# EAGLE design Shruthi-Analog-SMR4-mkII-v02 (EAGLE 5.09)
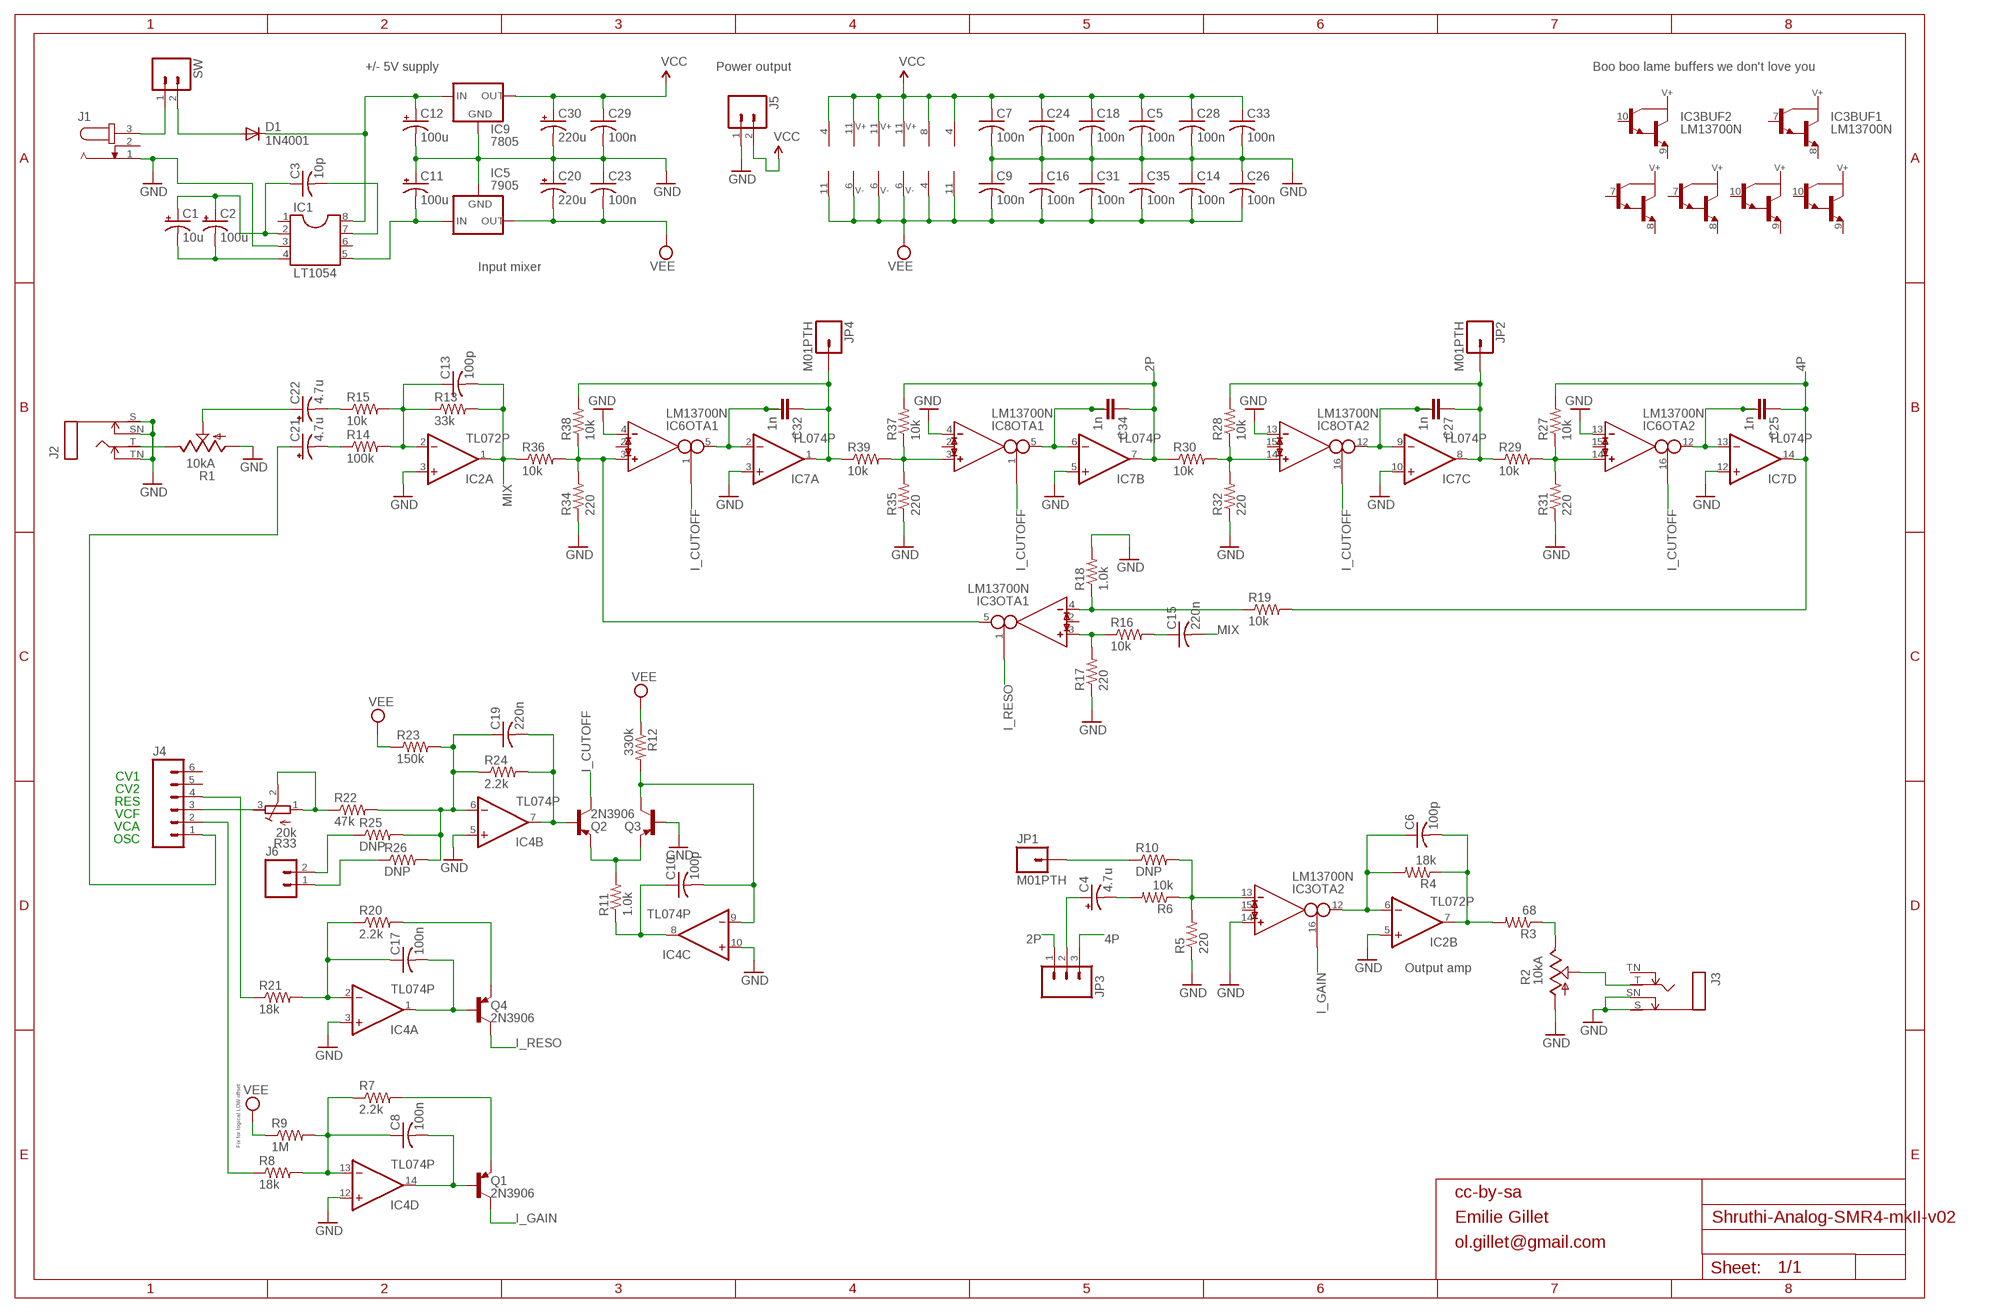
[diagram p0: schematic, sheet 1]

## Parts
C1  10u  CPOL-USE2.5-5  [E2,5-5]
C2  100u  CPOL-USE2.5-6  [E2,5-6]
C3  10p  C-US025-025X050  [C025-025X050]
C4  4.7u  CPOL-USE2.5-6  [E2,5-6]
C5  100n  C-US025-025X050  [C025-025X050]
C6  100p  C-US025-025X050  [C025-025X050]
C7  100n  C-US025-025X050  [C025-025X050]
C8  100n  C-US025-025X050  [C025-025X050]
C9  100n  C-US025-025X050  [C025-025X050]
C10  100p  C-US025-025X050  [C025-025X050]
C11  100u  CPOL-USE2.5-7  [E2,5-7]
C12  100u  CPOL-USE2.5-7  [E2,5-7]
C13  100p  C-US025-025X050  [C025-025X050]
C14  100n  C-US025-025X050  [C025-025X050]
C15  220n  C-US025-025X050  [C025-025X050]
C16  100n  C-US025-025X050  [C025-025X050]
C17  100n  C-US025-025X050  [C025-025X050]
C18  100n  C-US025-025X050  [C025-025X050]
C19  220n  C-US025-025X050  [C025-025X050]
C20  220u  CPOL-USE5-10.5  [E5-10,5]
C21  4.7u  CPOL-USE2.5-6  [E2,5-6]
C22  4.7u  CPOL-USE2.5-6  [E2,5-6]
C23  100n  C-US025-025X050  [C025-025X050]
C24  100n  C-US025-025X050  [C025-025X050]
C25  1n  C-2.5-5/2  [C2.5/5-2]
C26  100n  C-US025-025X050  [C025-025X050]
C27  1n  C-2.5-5/2  [C2.5/5-2]
C28  100n  C-US025-025X050  [C025-025X050]
C29  100n  C-US025-025X050  [C025-025X050]
C30  220u  CPOL-USE5-10.5  [E5-10,5]
C31  100n  C-US025-025X050  [C025-025X050]
C32  1n  C-2.5-5/2  [C2.5/5-2]
C33  100n  C-US025-025X050  [C025-025X050]
C34  1n  C-2.5-5/2  [C2.5/5-2]
C35  100n  C-US025-025X050  [C025-025X050]
D1  1N4001  1N4004  [DO41-10]
IC1  LT1054  DIL8  [DIL08]
IC2  TL072P  [DIL08]
IC3  LM13700N  [DIL16]
IC4  TL074P  TL084P  [DIL14]
IC5  7905  79XXS  [79XXS]
IC6  LM13700N  [DIL16]
IC7  TL074P  TL084P  [DIL14]
IC8  LM13700N  [DIL16]
IC9  7805  78XXS  [78XXS]
J1  JACK-PLUG2  [SPC4078_BIG_HOLES]
J2  MONOSWS  [NMJ4HC-S]
J3  MONOSWS  [NMJ4HC-S]
J4  M06SIP  [1X06]
J5  M02PTH  [1X02]
J6  M02PTH  [1X02]
JP1  M01PTH  [1X01]
JP2  M01PTH  [1X01]
JP3  M03PTH  [1X03]
JP4  M01PTH  [1X01]
Q1  2N3906  2N3906-  [TO92-]
Q2  2N3906  2N3906-  [TO92-]
Q3  2N3906  2N3906-  [TO92-]
Q4  2N3906  2N3906-  [TO92-]
R1  10kA  POT_USCABLED  [CABLE_POT_6MM]
R2  10kA  POT_USCABLED  [CABLE_POT_6MM]
R3  68  R-US_0204/7  [0204/7]
R4  18k  R-US_0204/7  [0204/7]
R5  220  R-US_0204/7  [0204/7]
R6  10k  R-US_0204/7  [0204/7]
R7  2.2k  R-US_0204/7  [0204/7]
R8  18k  R-US_0204/7  [0204/7]
R9  1M  R-US_0204/7  [0204/7]
R10  DNP  R-US_0204/2V  [0204V]
R11  1.0k  R-US_0204/7  [0204/7]
R12  330k  R-US_0204/7  [0204/7]
R13  33k  R-US_0204/7  [0204/7]
R14  100k  R-US_0204/7  [0204/7]
R15  10k  R-US_0204/7  [0204/7]
R16  10k  R-US_0204/7  [0204/7]
R17  220  R-US_0204/7  [0204/7]
R18  1.0k  R-US_0204/7  [0204/7]
R19  10k  R-US_0204/7  [0204/7]
R20  2.2k  R-US_0204/7  [0204/7]
R21  18k  R-US_0204/7  [0204/7]
R22  47k  R-US_0204/7  [0204/7]
R23  150k  R-US_0204/7  [0204/7]
R24  2.2k  R-US_0204/7  [0204/7]
R25  DNP  R-US_0204/2V  [0204V]
R26  DNP  R-US_0204/2V  [0204V]
R27  10k  R-US_0204/7  [0204/7]
R28  10k  R-US_0204/7  [0204/7]
R29  10k  R-US_0204/7  [0204/7]
R30  10k  R-US_0204/7  [0204/7]
R31  220  R-US_0204/7  [0204/7]
R32  220  R-US_0204/7  [0204/7]
R33  20k  R-TRIMM3296X  [RTRIM3296X]
R34  220  R-US_0204/7  [0204/7]
R35  220  R-US_0204/7  [0204/7]
R36  10k  R-US_0204/7  [0204/7]
R37  10k  R-US_0204/7  [0204/7]
R38  10k  R-US_0204/7  [0204/7]
R39  10k  R-US_0204/7  [0204/7]
SW  M02PTH  [1X02]

## Nets
2P: C34.1 IC7.7(B:OUT) JP3.1 R30.1 R37.2
4P: C25.1 IC7.14(D:OUT) JP3.3 R19.2 R27.2
GND: C5.2 C7.2 C9.1 C11.+ C12.- C14.1 C16.1 C18.2 C20.+ C23.1 C24.2 C26.1 C28.2 C29.2 C30.- C31.1 C33.2 C35.1 IC1.3 IC2.3(A:+IN) IC2.5(B:+IN) IC3.14(OTA2:IN_P) IC4.3(A:+IN) IC4.5(B:+IN) IC4.10(C:+IN) IC4.12(D:+IN) IC5.GND IC6.4(OTA1:IN_N) IC6.13(OTA2:IN_N) IC7.3(A:+IN) IC7.5(B:+IN) IC7.10(C:+IN) IC7.12(D:+IN) IC8.4(OTA1:IN_N) IC8.13(OTA2:IN_N) IC9.GND J1.1 J2.S J2.SN J2.TN J3.S J3.SN J5.1 Q3.2(B) R1.A R2.A R5.1 R17.1 R18.2 R31.1 R32.1 R34.1 R35.1
I_CUTOFF: IC6.1(OTA1:I_BIAS) IC6.16(OTA2:I_BIAS) IC8.1(OTA1:I_BIAS) IC8.16(OTA2:I_BIAS) Q2.1(C)
I_GAIN: IC3.16(OTA2:I_BIAS) Q1.1(C)
I_RESO: IC3.1(OTA1:I_BIAS) Q4.1(C)
MIX: C13.2 C15.2 IC2.1(A:OUT) R13.2 R36.1
N$1: JP1.1 R10.1
N$2: C19.2 IC4.7(B:OUT) Q2.2(B) R24.2
N$3: R22.1 R33.1(E) R33.2(S)
N$4: J4.3 R33.3(A)
N$6: C13.1 IC2.2(A:-IN) R13.1 R14.2 R15.2
N$7: Q2.3(E) Q3.3(E) R11.2
N$8: C4.+ JP3.2
N$9: C10.1 IC4.8(C:OUT) R11.1
N$10: C10.2 IC4.9(C:-IN) Q3.1(C) R12.2
N$11: J4.4 R21.1
N$12: IC3.5(OTA1:OUT) IC6.3(OTA1:IN_P) R34.2 R36.2 R38.1
N$13: J3.T R2.S
N$14: C32.1 IC7.1(A:OUT) JP4.1 R38.2 R39.1
N$16: IC8.3(OTA1:IN_P) R35.2 R37.1 R39.2
N$17: C4.- R6.2
N$18: J6.2 R25.1
N$20: IC8.14(OTA2:IN_P) R28.1 R30.2 R32.2
N$21: C15.1 R16.2
N$22: J6.1 R26.1
N$24: IC6.14(OTA2:IN_P) R27.1 R29.2 R31.2
N$25: R2.E R3.1
N$26: C27.1 IC7.8(C:OUT) JP2.1 R28.2 R29.1
N$27: C32.2 C32.3 IC6.5(OTA1:OUT) IC7.2(A:-IN)
N$28: C34.2 C34.3 IC7.6(B:-IN) IC8.5(OTA1:OUT)
N$29: IC3.4(OTA1:IN_N) R18.1 R19.1
N$30: C17.2 IC4.1(A:OUT) Q4.2(B)
N$31: C8.2 IC4.14(D:OUT) Q1.2(B)
N$33: IC3.3(OTA1:IN_P) R16.1 R17.2
N$34: IC3.13(OTA2:IN_N) R5.2 R6.1 R10.2
N$35: C21.+ J4.1
N$36: C27.2 C27.3 IC7.9(C:-IN) IC8.12(OTA2:OUT)
N$37: C25.2 C25.3 IC6.12(OTA2:OUT) IC7.13(D:-IN)
N$38: J2.T R1.E
N$39: C21.- R14.1
N$40: C19.1 IC4.6(B:-IN) R22.2 R23.2 R24.1 R25.2 R26.2
N$44: J1.3 SW.1
N$45: J4.2 R8.1
N$46: C12.+ D1.C IC1.8 IC9.IN
N$47: C1.+ C2.+ C3.1 IC1.2
N$48: C1.- C2.- IC1.4
N$49: C3.2 IC1.7
N$51: C8.1 IC4.13(D:-IN) R7.1 R8.2 R9.2
N$57: C17.1 IC4.2(A:-IN) R20.1 R21.2
N$58: C11.- IC1.5 IC5.IN
N$59: D1.A SW.2
N$60: Q4.3(E) R20.2
N$63: C6.2 IC2.7(B:OUT) R3.2 R4.1
N$66: C22.+ R1.S
N$68: Q1.3(E) R7.2
N$70: C6.1 IC2.6(B:-IN) IC3.12(OTA2:OUT) R4.2
N$72: C22.- R15.1
VCC: C5.1 C7.1 C18.1 C24.1 C28.1 C29.1 C30.+ C33.1 IC2.8(P:V+) IC3.11(SUPPLY:V+) IC4.4(P:V+) IC6.11(SUPPLY:V+) IC7.4(P:V+) IC8.11(SUPPLY:V+) IC9.OUT J5.2
VEE: C9.2 C14.2 C16.2 C20.- C23.2 C26.2 C31.2 C35.2 IC2.4(P:V-) IC3.6(SUPPLY:V-) IC4.11(P:V-) IC5.OUT IC6.6(SUPPLY:V-) IC7.11(P:V-) IC8.6(SUPPLY:V-) R9.1 R12.1 R23.1
Unconnected: IC1.1 IC1.6 IC3.2(OTA1:I_DIODE) IC3.7(BUF1:B) IC3.8(BUF1:E) IC3.9(BUF2:E) IC3.10(BUF2:B) IC3.15(OTA2:I_DIODE) IC6.2(OTA1:I_DIODE) IC6.7(BUF1:B) IC6.8(BUF1:E) IC6.9(BUF2:E) IC6.10(BUF2:B) IC6.15(OTA2:I_DIODE) IC8.2(OTA1:I_DIODE) IC8.7(BUF1:B) IC8.8(BUF1:E) IC8.9(BUF2:E) IC8.10(BUF2:B) IC8.15(OTA2:I_DIODE) J1.2 J3.TN J4.5 J4.6

## Notes on the sheet
- +/- 5V supply | Power output | Boo boo lame buffers we don't love you
- Input mixer
- CV1
- CV2
- RES
- VCF
- VCA
- OSC
- Output amp
- Fix for logical LOW offset
- cc-by-sa
- Emilie Gillet
- ol.gillet@gmail.com

## Library data of the parts
C1 C2 C4 C11 C12 C20-C22 C30 = rcl:CPOL-US: POLARIZED CAPACITOR, American symbol
C3 C5-C10 C13-C19 C23 C24 C26 C28 C29 C31 C33 C35 = rcl:C-US: CAPACITOR, American symbol
C25 C27 C32 C34 = capacitor-wima:C-: CAPACITOR for alternative placement naming: default grid - extended grid/package width
D1 = diode:1N4004: DIODE general purpose rectifier, 1 A
IC1 = ic-package:DIL8: Dual In Line / Socket
IC2 = gm-ics:TL072: OP AMP
IC3 IC6 IC8 = ota:LM13700: Dual OTA with buffers
IC4 IC7 = linear:TL084: OP AMP
IC5 = v-reg:79XXS: VOLTAGE REGULATOR
IC9 = v-reg:78XXS: VOLTAGE REGULATOR
J1 = con-jack2:JACK-PLUG: DC POWER JACK Power Jack, DC, Right Angle, Through Hole, Rated 5A at 16VDC, PC Terminals Distributor: Farnell (www.Farnell.de) Drawing: 84N1161.pdf / 84N1162.pdf Manufacturer: SPC Technology (www.spctechnology.com) Type: SPC4077 / SPC 4078
J2 J3 = og-neutrik:MONOSW
J4 = SparkFun:M06: Header 6 Standard 6-pin 0.1" header. Use with straight break away headers (SKU : PRT-00116), right angle break away headers (PRT-00553), swiss pins (PRT-00743), machine pins (PRT-00117), and female headers (PRT-00115). Molex polarized connector foot print use with SKU : PRT-08094 with associated crimp pins and housings. NOTES ON THE VARIANTS LOCK and LOCK_LONGPADS... This footprint was designed to help hold the alignment of a through-hole component (i.e. 6-pin header) while soldering it into place. You may notice that each hole has been shifted either up or down by 0.005 of an inch from it's more standard position (which is a perfectly straight line). This slight alteration caused the pins (the squares in the middle) to touch the edges of the holes. Because they are alternating, it causes a "brace" to hold the component in place. 0.005 has proven to be the perfect amount of "off-center" position when using our standard breakaway headers. Although looks a little odd when you look at the bare footprint, once you have a header in there, the alteration is very hard to notice. Also, if you push a header all the way into place, it is covered up entirely on the bottom side. This idea of altering the position of holes to aid alignment will be further integrated into the Sparkfun Library for other footprints. It can help hold any component with 3 or more connection pins.
J5 J6 SW = SparkFun:M02: Header 2 Standard 2-pin 0.1" header. Use with straight break away headers (SKU : PRT-00116), right angle break away headers (PRT-00553), swiss pins (PRT-00743), machine pins (PRT-00117), and female headers (PRT-00115). Molex polarized connector foot print use with SKU : PRT-08233 with associated crimp pins and housings.
JP1 JP2 JP4 = SparkFun:M01: Header 1 Standard 1-pin 0.1" header. Use with straight break away headers (SKU : PRT-00116), right angle break away headers (PRT-00553), swiss pins (PRT-00743), machine pins (PRT-00117), and female headers (PRT-00115).
JP3 = SparkFun:M03: Header 3 Standard 3-pin 0.1" header. Use with straight break away headers (SKU : PRT-00116), right angle break away headers (PRT-00553), swiss pins (PRT-00743), machine pins (PRT-00117), and female headers (PRT-00115). Molex polarized connector foot print use with SKU : PRT-08232 with associated crimp pins and housings.
Q1-Q4 = gm-trans:2N3906: PNP Transistor
R1 R2 = pot-alps:POT_US
R3-R32 R34-R39 = rcl:R-US_: RESISTOR, American symbol
R33 = rcl:R-TRIMM: Trimm resistor

## Board
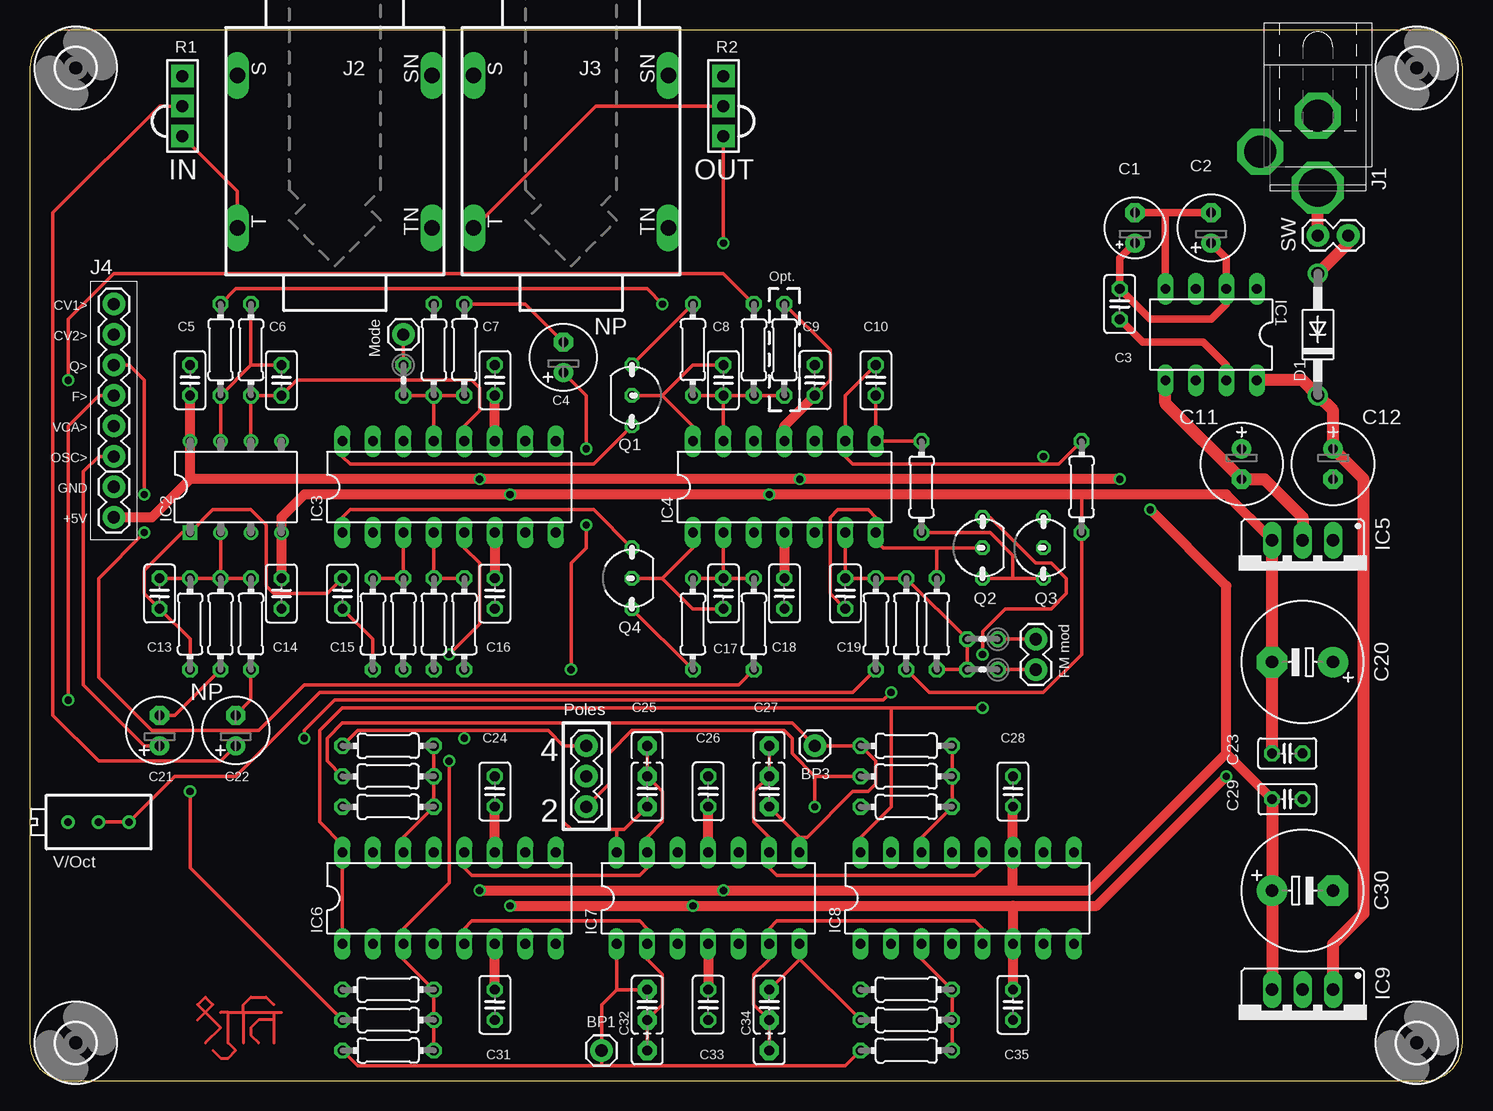
[diagram p1: board, top side]
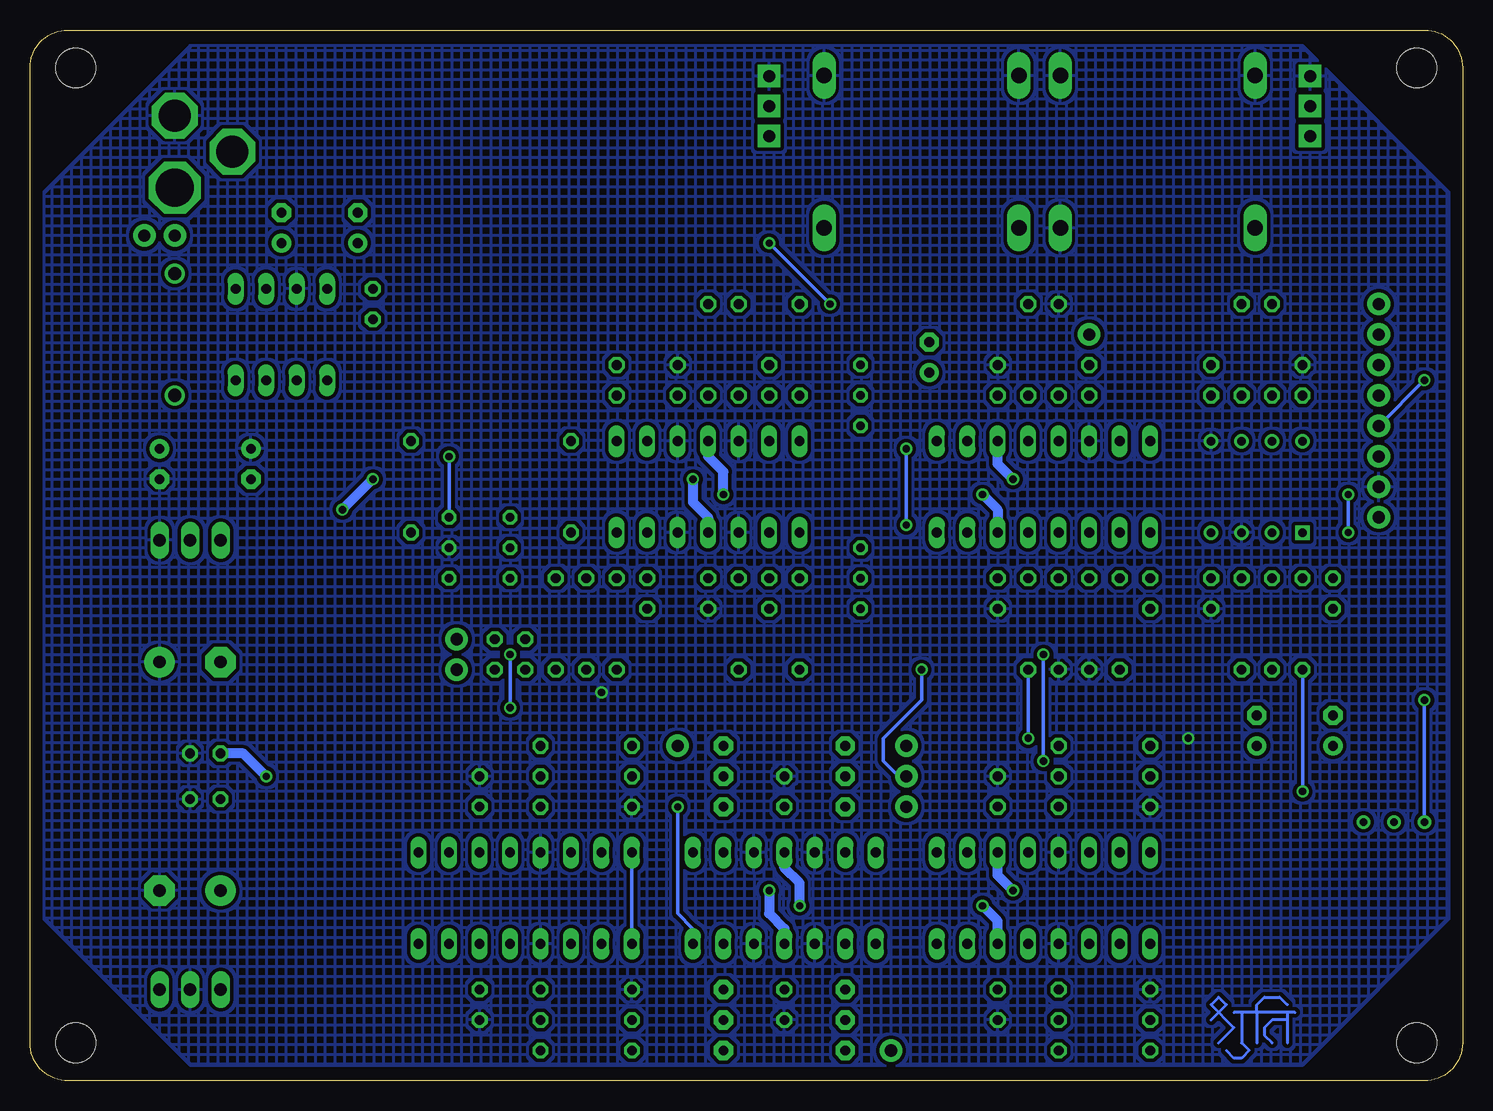
[diagram p2: board, bottom side, seen from below]

Size 119.38 x 87.62 mm. Coordinates in mm from the lower left corner, seen from the top.
Outline: 116.2,0 arc90 119.38,3.17 119.38,84.45 arc90 116.22,87.62 3.17,87.62 arc90 0,84.45 0,3.17 arc90 3.18,0 116.2,0
Copper layers used: Top, Bottom

### Footprints (pad centres in the part's own frame; a part is rotated, then mirrored left to right if it is on the bottom)
E2,5-5 = drill 0.813 pad 1.6 round: + -1.27,0 | drill 0.813 pad 1.6 octagon: - 1.27,0
E2,5-6 = drill 0.813 pad 1.6 round: + -1.27,0 | drill 0.813 pad 1.6 octagon: - 1.27,0
C025-025X050 = drill 0.813 octagon: 1 -1.27,0; 2 1.27,0
E2,5-7 = drill 0.813 pad 1.6 round: + -1.27,0 | drill 0.813 pad 1.6 octagon: - 1.27,0
E5-10,5 = drill 1.016 pad 2.54 round: + -2.54,0 | drill 1.016 pad 2.54 octagon: - 2.54,0
C2.5/5-2 = drill 0.813 pad 1.6 octagon: 1 -1.27,0; 2 1.27,0; 3 3.81,0
DO41-10 = drill 1.118 round: A 5.08,0; C -5.08,0
DIL08 = drill 0.813 long: 1 -3.81,-3.81; 2 -1.27,-3.81; 3 1.27,-3.81; 4 3.81,-3.81; 5 3.81,3.81; 6 1.27,3.81; 7 -1.27,3.81; 8 -3.81,3.81
DIL08' = drill 0.7 square: 1 -3.81,-3.81 | drill 0.7 round: 2 -1.27,-3.81; 3 1.27,-3.81; 4 3.81,-3.81; 5 3.81,3.81; 6 1.27,3.81; 7 -1.27,3.81; 8 -3.81,3.81
DIL16 = drill 0.813 long: 1 -8.89,-3.81; 2 -6.35,-3.81; 3 -3.81,-3.81; 4 -1.27,-3.81; 5 1.27,-3.81; 6 3.81,-3.81; 7 6.35,-3.81; 8 8.89,-3.81; 9 8.89,3.81; 10 6.35,3.81; 11 3.81,3.81; 12 1.27,3.81; 13 -1.27,3.81; 14 -3.81,3.81; 15 -6.35,3.81; 16 -8.89,3.81
DIL14 = drill 0.813 long: 1 -7.62,-3.81; 2 -5.08,-3.81; 3 -2.54,-3.81; 4 0,-3.81; 5 2.54,-3.81; 6 5.08,-3.81; 7 7.62,-3.81; 8 7.62,3.81; 9 5.08,3.81; 10 2.54,3.81; 11 0,3.81; 12 -2.54,3.81; 13 -5.08,3.81; 14 -7.62,3.81
79XXS = drill 1.016 long: GND -2.54,-2.54; IN 0,-2.54; OUT 2.54,-2.54
78XXS = drill 1.016 long: GND 0,-2.54; IN -2.54,-2.54; OUT 2.54,-2.54
SPC4078_BIG_HOLES = drill 2.667 pad 3.81 octagon: 1 -0.46,0; 2 2.54,-4.8 | drill 3.175 pad 4.318 octagon: 3 5.54,0
NMJ4HC-S = drill 1.3 long: S 5.08,8.115; SN 5.08,-8.115; T -7.62,8.115; TN -7.62,-8.115
1X06 = drill 1.016 pad 1.88 round: 1 0,0; 2 2.54,0; 3 5.08,0; 4 7.62,0; 5 10.16,0; 6 12.7,0
1X02 = drill 1.016 pad 1.88 round: 1 0,0; 2 2.54,0
1X01 = drill 1.016 pad 1.88 round: 1 0,0
1X03 = drill 1.016 pad 1.88 round: 1 0,0; 2 2.54,0; 3 5.08,0
TO92- = drill 0.7 octagon: 1 2.54,0; 2 0,0; 3 -2.54,0
CABLE_POT_6MM = drill 1 pad 1.88 square: A -2.5,0; E 2.5,0; S 0,0
0204/7 = drill 0.813 octagon: 1 -3.81,0; 2 3.81,0
0204V = drill 0.813 octagon: 1 -1.27,0; 2 1.27,0
RTRIM3296X = drill 0.61 round: 1 0,-2.54; 2 0,0; 3 0,2.54
3,3 = hole 3.3: 0,0

### Placement (x,y rotation side)
C1  92.08,71.12 90 top
C2  98.42,71.12 90 top
C3  90.8,64.77 270 top
C4  44.45,60.33 90 top
C5  13.34,58.42 90 top
C6  20.96,58.42 90 top
C7  38.73,58.42 90 top
C8  57.78,58.42 90 top
C9  65.41,58.42 270 top
C10  70.48,58.42 90 top
C11  100.97,51.44 270 top
C12  108.58,51.44 270 top
C13  10.79,40.64 270 top
C14  20.96,40.64 90 top
C15  26.04,40.64 90 top
C16  38.73,40.64 90 top
C17  57.78,40.64 270 top
C18  62.87,40.64 270 top
C19  67.95,40.64 270 top
C20  106.05,34.92 180 top
C21  10.79,29.21 90 top
C22  17.14,29.21 90 top
C23  104.78,27.3 180 top
C24  38.73,24.13 90 top
C25  51.44,24.13 90 top
C26  56.52,24.13 270 top
C27  61.59,24.13 90 top
C28  81.92,24.13 90 top
C29  104.78,23.49 0 top
C30  106.05,15.88 0 top
C31  38.73,6.35 90 top
C32  51.44,6.35 270 top
C33  56.52,6.35 270 top
C34  61.59,6.35 270 top
C35  81.92,6.35 90 top
D1  107.31,62.23 90 top
IC1  98.42,62.23 180 top
IC2  TL072P  [DIL08']  17.14,49.53 0 top
IC3  34.93,49.53 0 top
IC4  62.87,49.53 0 top
IC5  106.05,42.55 180 top
IC6  34.93,15.24 0 top
IC7  56.52,15.24 0 top
IC8  78.11,15.24 0 top
IC9  106.05,5.08 180 top
J1  107.31,80.01 270 top
J2  25.4,78.74 90 top
J3  45.09,78.74 90 top
J4  6.99,52.07 90 top
J5  6.99,49.53 270 top
J6  83.82,34.29 90 top
JP1  31.11,62.23 0 top
JP2  65.41,27.94 0 top
JP3  46.35,22.86 90 top
JP4  47.62,2.54 0 top
Q1  50.16,57.15 270 top
Q2  79.38,44.45 90 top
Q3  84.45,44.45 90 top
Q4  50.16,41.91 90 top
R1  12.7,81.28 270 top
R2  57.78,81.28 270 top
R3  15.88,60.96 270 top
R4  18.41,60.96 270 top
R5  33.66,60.96 270 top
R6  36.2,60.96 90 top
R7  55.24,60.96 90 top
R8  60.33,60.96 270 top
R9  62.87,60.96 270 top
R10  31.11,58.42 270 top
R11  74.3,49.53 270 top
R12  87.63,49.53 90 top
R13  13.34,38.1 270 top
R14  15.88,38.1 90 top
R15  18.41,38.1 90 top
R16  28.57,38.1 270 top
R17  31.11,38.1 90 top
R18  33.66,38.1 270 top
R19  36.2,38.1 270 top
R20  55.24,38.1 270 top
R21  60.33,38.1 90 top
R22  70.48,38.1 90 top
R23  73.03,38.1 90 top
R24  75.56,38.1 90 top
R25  79.38,36.83 180 top
R26  79.38,34.29 180 top
R27  29.84,27.94 180 top
R28  73.03,27.94 180 top
R29  29.84,25.4 0 top
R30  73.03,25.4 0 top
R31  29.84,22.86 0 top
R32  73.03,22.86 0 top
R33  5.71,21.59 90 top
R34  29.84,7.62 0 top
R35  73.03,7.62 0 top
R36  29.84,5.08 0 top
R37  73.03,5.08 180 top
R38  29.84,2.54 180 top
R39  73.03,2.54 0 top
SW  107.31,70.48 0 top
U$1  [3,3]  3.81,84.45 0 top
U$2  [3,3]  115.57,84.45 0 top
U$3  [V2_LOGO_SHRUTHI_ANALOG]  100.33,85.73 180 top
U$4  [3,3]  3.81,3.17 0 top
U$5  [3,3]  115.57,3.17 0 top
U$6  [V2_LOGO_DINGBAT1]  86.36,-0.64 0 top

### Tracks (layer width: path | path; a pad name or v marks a point on that pad's centre or on a via)
2P  (via drill 0.6)
  Top 0.305: C34.1 64.14,10.16 | 64.14,10.16 R37.2 | 64.14,10.16 IC7.7 | v65.41,22.86 65.41,25.4 | 65.41,25.4 63.5,27.3 63.5,28.57 62.87,29.21 50.16,29.21 48.26,27.3 48.26,24.76 JP3.1 | 65.41,25.4 R30.1
  Bottom 0.305: IC7.7 64.14,12.7 65.41,13.97 v65.41,22.86
4P  (via drill 0.6)
  Top 0.305: R27.2 27.3,29.21 36.2,29.21 | 36.2,29.21 v36.2,28.57 | 36.2,29.21 43.18,29.21 44.45,27.94 | 44.45,27.94 44.45,21.59 45.09,20.95 48.89,20.95 | 44.45,27.94 JP3.3 | 48.89,20.95 49.53,20.95 C25.1 | 48.89,20.95 IC7.14
  Bottom 0.305: v36.2,28.57 R19.2
GND  (via drill 0.6)
  Top 0.305: v22.86,28.57 22.86,29.21 25.4,31.75 71.12,31.75 v71.75,32.38
  pour Bottom (isolate 0.305, hatched): 118.75,73.66 106.05,86.36 13.34,86.36 0.64,73.66 0.64,13.97 13.34,1.27 106.05,1.27 118.75,13.97
I_CUTOFF  (via drill 0.6)
  Top 0.305: IC6.1 IC6.16 26.04,19.68 24.13,21.59 24.13,29.21 26.04,31.11 71.75,31.11 | IC8.16 69.22,20.32 71.75,22.86 71.75,31.11 | 71.75,31.11 v79.38,31.11 | Q2.1 80.01,46.99 83.82,43.18 85.09,43.18 86.36,41.91 86.36,40.64 85.09,39.37 81.28,39.37 79.38,37.47 v79.38,35.56
  Bottom 0.305: IC8.16 IC8.1 | v79.38,31.11 v79.38,35.56
I_GAIN
  Top 0.305: IC3.16 26.04,52.07 26.67,51.44 46.99,51.44 Q1.1
I_RESO
  Top 0.305: Q4.1 46.99,47.62 26.67,47.62 26.04,46.99 IC3.1
MIX  (via drill 0.6)
  Top 0.305: C15.2 24.77,40.64 20.32,40.64 19.68,41.28 19.68,46.36 18.41,47.62 15.24,47.62 IC2.1 12.7,45.72 9.53,42.55 9.53,40.64 C13.2 13.34,36.83 R13.2 | R36.1 13.34,17.78 v13.34,24.13
  Bottom 0.305: v13.34,24.13 R13.2
N$1
  Top 0.305: R10.1 JP1.1
N$2
  Top 0.305: C19.2 66.67,40.64 66.67,46.99 67.31,47.62 69.85,47.62 70.48,46.99 IC4.7 70.48,45.09 71.12,44.45 75.56,44.45 | 75.56,44.45 Q2.2 | 75.56,44.45 R24.2
N$3
  Top 0.305: R33.2 R33.1 12.07,25.4 17.14,25.4 24.13,32.38 68.58,32.38 R22.1
N$4  (via drill 0.6)
  Top 0.305: v3.18,31.75 3.18,54.61 5.71,57.15 J4.3
  Bottom 0.305: R33.3 v3.18,31.75
N$6
  Top 0.305: C13.1 R13.1 R14.2 | R14.2 R15.2 | R14.2 IC2.2
N$7
  Top 0.305: 81.92,41.91 Q2.3 | 81.92,41.91 Q3.3 | R11.2 80.01,45.72 81.92,43.82 81.92,41.91
N$8  (via drill 0.6)
  Top 0.305: v46.35,52.71 46.35,57.15 C4.+ | v45.09,34.29 45.09,43.18 46.35,44.45 v46.35,46.36
  Bottom 0.305: v46.35,46.36 v46.35,52.71 | JP3.2 46.99,25.4 48.26,26.67 48.26,28.57 45.09,31.75 v45.09,34.29
N$9
  Top 0.305: R11.1 IC4.8 C10.1
N$10  (via drill 0.6)
  Top 0.305: 84.45,51.44 68.58,51.44 67.95,52.07 IC4.9 67.95,57.15 C10.2 | 84.45,51.44 85.72,51.44 R12.2 | 84.45,51.44 v84.45,52.07
  Bottom 0.305: v84.45,52.07 Q3.1
N$11  (via drill 0.6)
  Top 0.305: R21.1 59.05,33.02 22.86,33.02 19.05,29.21 10.16,29.21 5.71,33.66 5.71,41.91 v9.53,45.72 | v9.53,48.9 9.53,58.42 8.26,59.69 J4.4
  Bottom 0.305: v9.53,45.72 v9.53,48.9
N$12  (via drill 0.6)
  Top 0.305: R38.1 R36.2 R34.2 31.11,10.16 IC6.3 31.11,12.7 34.93,16.51 v34.93,26.67 | v34.93,35.56 37.47,38.1 37.47,43.18 36.2,44.45 IC3.5
  Bottom 0.305: v34.93,26.67 v34.93,35.56
N$13
  Top 0.305: J3.T 47.13,81.28 R2.S
N$14
  Top 0.305: R38.2 27.3,1.27 47.62,1.27 | 48.89,7.62 C32.1 | 48.89,7.62 IC7.1 | 47.62,1.27 JP4.1 47.62,6.35 48.89,7.62 | R39.1 67.95,1.27 47.62,1.27
N$15
  Bottom 0.254: 20.32,3.17 19.05,4.45 20.96,6.35 20.32,6.98 19.68,6.35 20.96,5.08
N$16
  Top 0.305: IC8.3 74.3,10.16 R35.2 R37.1 R39.2
N$17
  Top 0.305: R6.2 41.27,64.77 C4.-
N$18
  Top 0.305: R25.1 J6.2
N$20
  Top 0.305: IC8.14 74.3,20.32 R32.2 R30.2 R28.1
N$21
  Top 0.305: R16.2 28.57,36.83 C15.1
N$22
  Top 0.305: R26.1 J6.1
N$24
  Top 0.305: R29.2 R27.1 R31.2 31.11,20.32 IC6.14
N$25  (via drill 0.6)
  Top 0.305: R3.1 17.14,66.04 51.44,66.04 v52.7,64.77 | v57.78,69.85 R2.E
  Bottom 0.305: v52.7,64.77 v57.78,69.85
N$26
  Top 0.305: R29.1 24.77,26.67 24.77,28.57 26.04,29.84 63.5,29.84 JP2.1 R28.2 70.48,26.67 70.48,24.76 69.85,24.13 68.58,24.13 64.77,20.32 64.14,20.32 | 64.14,20.32 C27.1 | 64.14,20.32 IC7.8
N$27
  Top 0.305: C32.3 C32.2 52.7,6.35 52.7,8.89 51.44,10.16 IC7.2 51.44,12.7 50.8,13.34 36.83,13.34 36.2,12.7 IC6.5
N$28
  Top 0.305: C34.3 C34.2 60.33,6.35 60.33,8.89 61.59,10.16 IC7.6 61.59,12.7 62.23,13.34 78.74,13.34 79.38,12.7 IC8.5
N$29
  Top 0.305: IC3.4 R18.1 R19.1
N$30
  Top 0.305: IC4.1 55.24,44.45 52.7,41.91 | 52.7,41.91 55.24,39.37 C17.2 | Q4.2 52.7,41.91
N$31
  Top 0.305: IC4.14 55.24,54.61 52.7,57.15 | 52.7,57.15 55.24,59.69 C8.2 | 52.7,57.15 Q1.2
N$33
  Top 0.305: IC3.3 R17.2 R16.1
N$34
  Top 0.305: R5.2 R10.2 | R5.2 R6.1 | IC3.13 R5.2
N$35
  Top 0.305: J4.1 5.71,52.07 4.45,50.8 4.45,33.02 9.53,27.94 C21.+
N$36
  Top 0.305: C27.3 C27.2 60.33,24.13 60.33,21.59 61.59,20.32 IC7.9 61.59,17.78 62.23,17.14 78.74,17.14 79.38,17.78 IC8.12
N$37
  Top 0.305: C25.3 C25.2 52.7,24.13 52.7,21.59 51.44,20.32 IC7.13 51.44,17.78 50.8,17.14 36.83,17.14 36.2,17.78 IC6.12
N$38
  Top 0.305: R1.E 17.29,74.2 J2.T
N$39
  Top 0.305: C21.- 12.07,30.48 R14.1
N$40
  Top 0.305: IC4.6 C19.1 R22.2 R23.2 R25.2 R26.2 R24.1
N$44
  Top 1.016: SW.1 J1.3
N$45  (via drill 0.6)
  Top 0.305: v3.18,58.42 3.18,63.5 6.99,67.31 57.78,67.31 R8.1
  Bottom 0.305: J4.2 v3.18,58.42
N$46
  Top 1.016: IC1.8 106.05,58.42 D1.C 108.58,55.88 C12.+ 111.12,50.16 111.12,13.97 108.58,11.43 IC9.IN
N$47
  Top 0.61: C1.+ 90.8,68.58 C3.1 93.34,63.5 98.42,63.5 99.69,64.77 IC1.2 99.69,68.58 C2.+
N$48
  Top 0.61: 94.61,72.39 C1.- | 94.61,72.39 C2.- | IC1.4 94.61,72.39
N$49
  Top 0.61: IC1.7 99.69,59.69 97.79,61.59 92.71,61.59 C3.2
N$51
  Top 0.305: IC4.13 C8.1 | C8.1 R7.1 | R9.2 R8.2 C8.1
N$52
  Bottom 0.254: 18.41,5.71 19.05,5.71 | 17.14,5.71 18.41,5.71 | 14.61,5.71 17.14,5.71 | 13.97,5.71 14.61,5.71 | 14.61,5.08 14.61,3.17 | 14.61,5.71 14.61,5.08 | 14.61,5.08 15.88,5.08 16.51,4.45 16.51,3.81 15.88,3.17 | 18.41,5.71 18.41,3.17 17.78,2.54 18.41,1.91 19.05,1.91 19.68,2.54 | 17.14,5.71 17.14,3.17 | 17.14,5.71 17.14,6.35 16.51,6.98 15.24,6.98 14.61,6.35
N$53
  Top 0.254: 14.61,3.17 15.88,4.45 13.97,6.35 14.61,6.98 15.24,6.35 13.97,5.08
N$54
  Top 0.254: 16.51,5.71 15.88,5.71 | 16.51,5.71 17.78,5.71 | 17.78,5.71 20.32,5.71 | 20.32,5.71 20.96,5.71 | 20.32,5.08 20.32,3.17 | 20.32,5.71 20.32,5.08 | 20.32,5.08 19.05,5.08 18.41,4.45 18.41,3.81 19.05,3.17 | 16.51,5.71 16.51,3.17 17.14,2.54 16.51,1.91 15.88,1.91 15.24,2.54 | 17.78,5.71 17.78,3.17 | 17.78,5.71 17.78,6.35 18.41,6.98 19.68,6.98 20.32,6.35
N$57
  Top 0.305: C17.1 IC4.2 | R20.1 C17.1 | C17.1 R21.2
N$58
  Top 1.016: IC5.IN 106.05,46.99 102.87,50.16 C11.- 94.61,56.52 IC1.5
N$59
  Top 1.016: D1.A 109.86,69.85 SW.2
N$60
  Top 0.305: Q4.3 R20.2
N$63
  Top 0.305: IC2.7 R3.2 18.41,59.69 | 18.41,59.69 R4.1 | 18.41,59.69 C6.2
N$66
  Top 0.305: R1.S 10.79,81.28 1.91,72.39 1.91,30.48 5.71,26.67 15.88,26.67 C22.+
N$68
  Top 0.305: Q1.3 R7.2
N$70
  Top 0.305: 18.41,52.71 IC2.6 R4.2 C6.1 22.23,58.42 36.83,58.42 37.47,57.79 37.47,55.88 36.2,54.61 IC3.12
N$72
  Top 0.305: C22.- 18.41,31.75 R15.1
VCC  (via drill 0.6)
  Top 0.813: C5.1 IC2.8 13.34,50.16 | 99.69,27.3 C29.1 | v93.34,47.62 99.69,41.28 99.69,27.3 | v90.8,50.16 v64.14,50.16 v37.47,50.16 13.34,50.16 | J5.2 10.16,46.99 13.34,50.16 | IC4.4 C18.1 | IC3.11 C7.1 | 81.92,15.88 IC8.11 C28.1 | 81.92,15.88 88.27,15.88 99.69,27.3 | 81.92,15.88 v57.78,15.88 v37.47,15.88 | IC7.4 C33.1 | IC6.11 C24.1
  Top 1.016: IC9.OUT C30.+ C29.1
  Bottom 0.813: v93.34,47.62 v90.8,50.16 | IC4.4 62.87,46.99 64.14,48.26 v64.14,50.16 | IC7.4 56.52,12.7 57.78,13.97 v57.78,15.88 | v37.47,50.16 38.73,51.44 IC3.11 | v37.47,15.88 38.73,17.14 IC6.11
VEE  (via drill 0.6)
  Top 0.305: C9.2 66.67,58.42 66.67,60.96 R9.1 | 87.63,48.9 R12.1 87.63,35.56 84.45,32.38 74.93,32.38 R23.1
  Top 0.813: C14.2 IC2.4 20.96,46.99 22.86,48.9 v40.01,48.9 v61.59,48.9 87.63,48.9 99.69,48.9 IC5.OUT | IC4.11 62.87,54.61 C9.2 | IC3.6 C16.2 | v40.01,14.61 v55.24,14.61 81.92,14.61 | 81.92,14.61 88.9,14.61 v99.69,25.4 | 81.92,14.61 IC8.6 C35.2 | IC7.11 C26.2 | C31.2 IC6.6
  Top 1.016: IC5.OUT C20.- C23.2
  Bottom 0.813: IC4.11 62.87,52.07 61.59,50.8 v61.59,48.9 | v99.69,25.4 101.6,27.3 C23.2 | IC7.11 56.52,17.78 55.24,16.51 v55.24,14.61 | v40.01,48.9 38.73,47.62 IC3.6 | v40.01,14.61 38.73,13.34 IC6.6

### Text on the board
tPlace: CV1> | CV2> | Q> | F> | VCA> | OSC> | GND | +5V | Poles | 4 | 2 | V/Oct
tNames: IN | OUT | Opt. | NP | Mode | FM mod | NP | BP3 | BP1
200bmp: cc-by-sa Emilie Gillet, 2012. v0.2